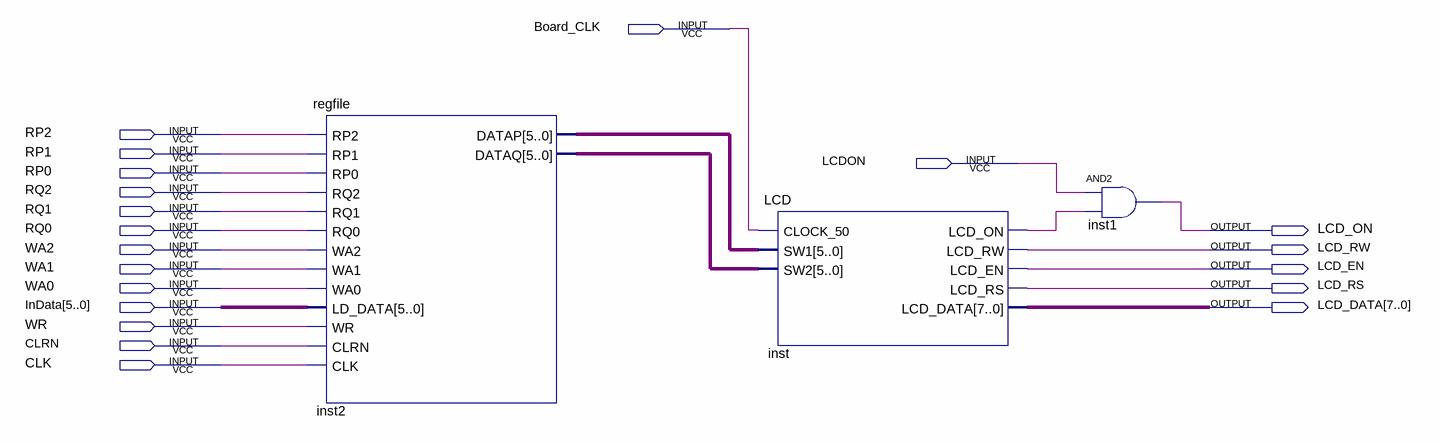
[diagram p0: schematic sheet]
// Quartus schematic EC_Lab.bdf as structural Verilog: 3 symbols, 20 pins
module EC_Lab (
  input  Board_CLK,
  input  RP2,
  input  RP1,
  input  LCDON,
  input  RP0,
  input  RQ2,
  input  RQ1,
  input  RQ0,
  input  WA2,
  input  WA1,
  input  WA0,
  input  [5:0] InData,
  input  WR,
  input  CLRN,
  input  CLK,
  output LCD_ON,
  output LCD_RW,
  output LCD_EN,
  output LCD_RS,
  output [7:0] LCD_DATA
);

  wire inst_lcd_on;
  wire [5:0] inst2_datap, inst2_dataq;

  regfile inst2 (
    .RP2(RP2), .RP1(RP1), .RP0(RP0), .RQ2(RQ2), .RQ1(RQ1), .RQ0(RQ0), .WA2(WA2), .WA1(WA1), .WA0(WA0),
    .LD_DATA(InData), .WR(WR), .CLRN(CLRN), .CLK(CLK), .DATAP(inst2_datap), .DATAQ(inst2_dataq));
  LCD inst (
    .CLOCK_50(Board_CLK), .SW1(inst2_datap), .SW2(inst2_dataq), .LCD_ON(inst_lcd_on), .LCD_RW(LCD_RW),
    .LCD_EN(LCD_EN), .LCD_RS(LCD_RS), .LCD_DATA(LCD_DATA));
  and inst1 (LCD_ON, LCDON, inst_lcd_on);
endmodule
